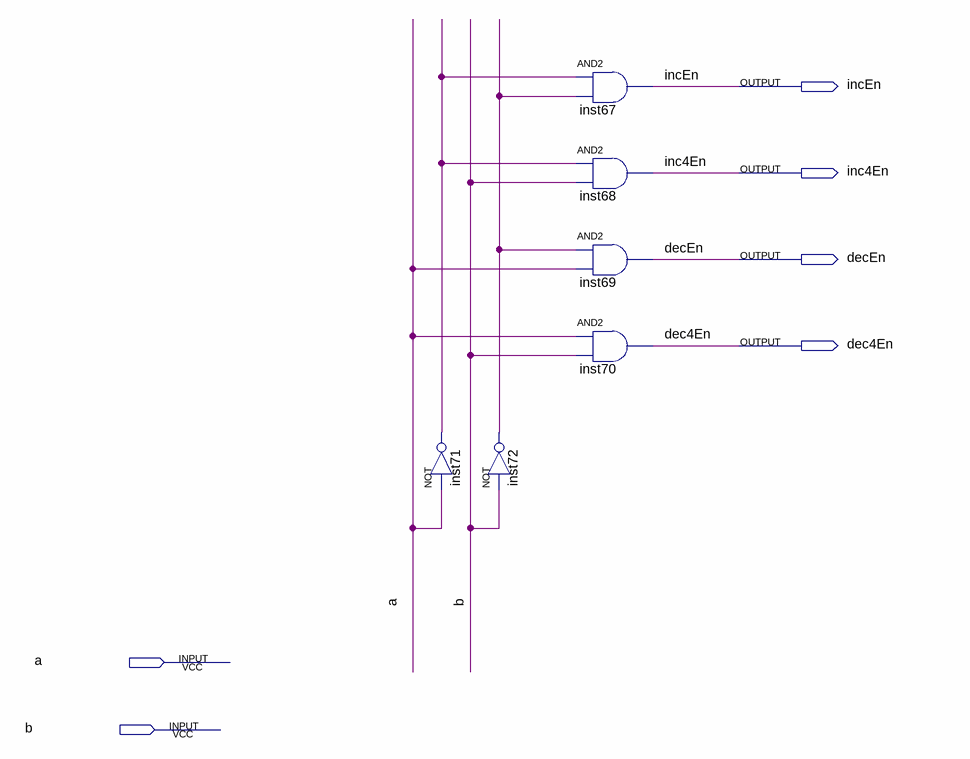
[diagram p0: schematic sheet]
// Quartus schematic testOPIndicator.bdf as structural Verilog: 6 symbols, 6 pins
module testOPIndicator (
  input  a,
  input  b,
  output incEn,
  output inc4En,
  output decEn,
  output dec4En
);

  wire inst71_out, inst72_out;

  not inst71 (inst71_out, a);
  not inst72 (inst72_out, b);
  and inst67 (incEn, inst71_out, inst72_out);
  and inst68 (inc4En, inst71_out, b);
  and inst69 (decEn, inst72_out, a);
  and inst70 (dec4En, a, b);
endmodule
